# EAGLE schematic daughterboard (EAGLE 6.6.0)
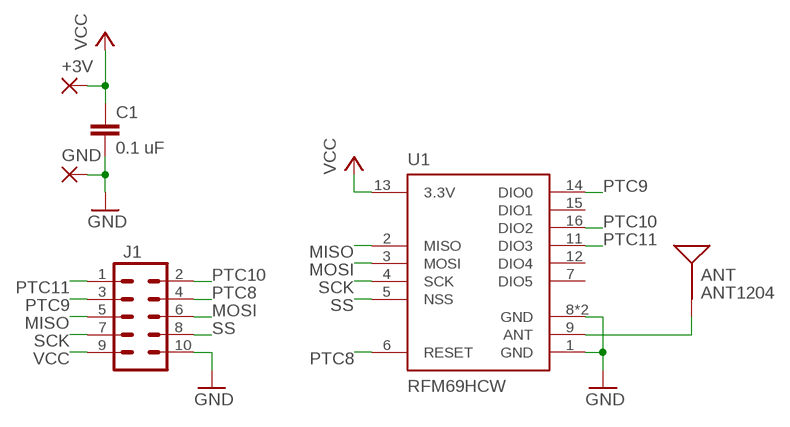
[diagram p0: schematic, sheet 1]

## Parts
+3V  1,6/0,9  [1,6/0,9]
ANT  ANT1204  [ANT1204]
C1  0.1 uF  C-EUC0603K  [C0603K]
GND  1,6/0,9  [1,6/0,9]
J1  M05X2SHD_SMD  [2X5-SHROUDED_SMD]
U1  RFM69HCW  [RFM69HCW-XXXS2]

## Nets
GND: C1.2 GND.1(P) J1.10 U1.1(GND) U1.8(GND) U1.10(GND)
MISO: J1.5 U1.2(MISO)
MOSI: J1.6 U1.3(MOSI)
N$1: ANT.FEED U1.9(ANT)
PTC8: J1.4 U1.6(RESET)
PTC9: J1.3 U1.14(DIO0)
PTC10: J1.2 U1.16(DIO2)
PTC11: J1.1 U1.11(DIO3)
SCK: J1.7 U1.4(SCK)
SS: J1.8 U1.5(NSS)
VCC: +3V.1(P) C1.1 J1.9 U1.13(3.3V)
Unconnected: U1.7(DIO5) U1.12(DIO4) U1.15(DIO1)

## Library data of the parts
+3V GND = wirepad:1,6/0,9: THROUGH-HOLE PAD
ANT = RF:ANT1204
C1 = rcl:C-EU: CAPACITOR, European symbol
J1 = SparkFun-Connectors:M05X2: Header 5x2 Standard 10-pin dual row 0.1" header. Commonly used with AVR-ISP. Use with Spark Fun Electronics SKU: PRT-00778
U1 = SparkFun-RF:RFM69H; PROD_ID: IC-11997, IC-12053